# Altium schematic sheet 8_Airframe-Misc.SchDoc
size A4; SheetNumber: 8; SheetTotal: 9
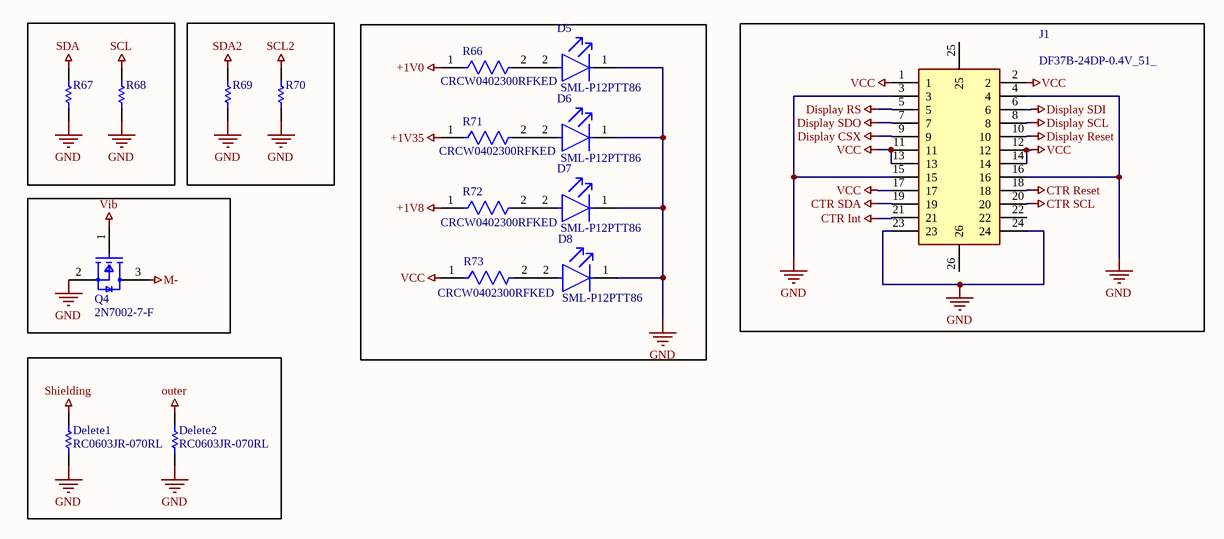
[diagram p0: 8_Airframe-Misc.SchDoc]

## Parts
D5  SML-P12PTT86  [FP-SML-P1-MFG]
D6  SML-P12PTT86  [FP-SML-P1-MFG]
D7  SML-P12PTT86  [FP-SML-P1-MFG]
D8  SML-P12PTT86  [FP-SML-P1-MFG]
Delete1  RC0603JR-070RL  [RESC1608X55X25ML10T15]
Delete2  RC0603JR-070RL  [RESC1608X55X25ML10T15]
J1  DF37B-24DP-0.4V_51_  [DF37B24DP04V51]
Q4  2N7002-7-F  [FP-SOT23-MFG]
R66  CRCW0402300RFKED  [FP-CRCW0402-e3-MFG]
R67  ERJ-2RKF4701X  [RESC1005X40X25ML05T05]  (value not drawn)
R68  ERJ-2RKF4701X  [RESC1005X40X25ML05T05]  (value not drawn)
R69  ERJ-2RKF4701X  [RESC1005X40X25ML05T05]  (value not drawn)
R70  ERJ-2RKF4701X  [RESC1005X40X25ML05T05]  (value not drawn)
R71  CRCW0402300RFKED  [FP-CRCW0402-e3-MFG]
R72  CRCW0402300RFKED  [FP-CRCW0402-e3-MFG]
R73  CRCW0402300RFKED  [FP-CRCW0402-e3-MFG]

## Nets
+1V0: R66.1
+1V8: R72.1
+1V35: R71.1
CTR Int: J1.21
CTR Reset: J1.18
CTR SCL: J1.20
CTR SDA: J1.19
Display CSX: J1.9
Display Reset: J1.10
Display RS: J1.5
Display SCL: J1.8
Display SDI: J1.6
Display SDO: J1.7
GND: D5.1(C) D6.1(C) D7.1(C) D8.1(C) Delete1.1 Delete2.1 J1.3 J1.4 J1.15 J1.16 J1.23 J1.24 Q4.2(S) R67.1 R68.1 R69.1 R70.1
M-: Q4.3(D)
outer: Delete2.2
SCL: R68.2
SCL2: R70.2
SDA: R67.2
SDA2: R69.2
Shielding: Delete1.2
VCC: J1.1 J1.2 J1.11 J1.12 J1.13 J1.14 J1.17 R73.1
Vib: Q4.1(G)
NetD5_2: D5.2(A) R66.2
NetD6_2: D6.2(A) R71.2
NetD7_2: D7.2(A) R72.2
NetD8_2: D8.2(A) R73.2

Not connected (* = marked no-connect by the designer): J1 22 25 26

## Library data of the parts
D5-D8 = CMP-08952-000020-1: LED GREEN CLEAR 1006 SMD; Manufacturer: Rohm; Led Orientation: Top View; Wavelength: 560nm; Forward Current: 20mA; Reverse Voltage: 5V; Power Dissipation: 52mW; Forward Voltage: 2.1V; Luminous Intensity: 10mcd; Device Class L1: Optoelectronics; Digikey Description: LED GREEN CLEAR 1006 SMD; Lead Free: Yes; Manufacturer Part Number: SML-P12PTT86; Temperature Range High: +85°C; Octopart: https://octopart.com/sml-p12ptt86-rohm-9290705; Device Class L2: LEDs; Colour: Green; RoHS: TRUE; Height: 0.25mm; Automotive: No; Device Class L3: unset; Temperature Range Low: -40°C; ComponentLink2Description: Datasheet; Mouser Description: Standard LEDs - SMD SMD Green 13 mcd height=0.2; Category: Diode; ComponentLink2URL: https://www.rohm.com/datasheet/SML-P12DT(R); Temperature: -40°C to +85°C; Package: SML-P1
Delete1 Delete2 = CMP-2100-03667-1: Chip Resistor, 0 Ohm, +/- 5%, 0.1 W, -55 to 155 degC, 0603 (1608 Metric), RoHS, Tape and Reel; Manufacturer: Yageo; Temperature Coefficient: 200ppm/degreesC; Voltage Rating: 50V; Power Rating: 100mW; Resistance: 0mOhm; Width: 0.8mm; Max Operating Temperature: 155degC; Tolerance: 5%; Package Reference: 0603; Height: 0.45mm; Depth: 0.8mm; Package Description: 2-Pin Surface Mount Device, Body 1.6 x 0.8 mm; Termination: SMD/SMT; Package Quantity: 5000; Case/Package: 0603; Case Code (Imperial): 0603; Radiation Hardening: No; Number of Pins: 2; Length: 1.6mm; Lead Free: LeadFree; Voltage Rating (DC): 50V; Military Standard: Not; Datasheet URL: http://www.yageo.com/NewPortal/yageodocoutput?fileName=/pdf/R-Chip/PYu-RC_Group_51_RoHS_L_5.pdf; Manufacturer URL: http://www.yageo.com/; Packaging: TapeandReel; Case Code (Metric): 1608; Min Operating Temperature: -55degC; Composition: ThickFilm; RoHSCompliant: true; Contact Plating: Tin; Datasheet Version: Rev. 5, 10/2016; REACH SVHC: NoSVHC
J1 = DF37B-24DP-0.4V_51_: Connector; Manufacturer_Name: Hirose; Manufacturer_Part_Number: DF37B-24DP-0.4V(51); Datasheet Link: https://www.hirose.com/product/download/?distributor=digikey&type=2d&lang=en&num=DF37B-24DP-0.4V(51); Mouser Part Number: 798-DF37B24DP04V51; Mouser Price/Stock: https://www.mouser.co.uk/ProductDetail/Hirose-Connector/DF37B-24DP-04V51?qs=eDUdFcBPps0B7iwhROz75A%3D%3D
Q4 = CMP-2000-04929-2: MOSFET N-CH 60V 115MA SOT23-3; Turn-On Delay Time: 7ns; Turn-Off Delay Time: 11ns; Drain to Source Resistance: 7.5R; Rise Time: 3ns; Drain to Source Breakdown Voltage: 70V; Input Capacitance: 50pF; Number of Elements: 1; Power Dissipation: 540mW; Max Power Dissipation: 300mW; Fall Time: 5.6ns; Gate to Source Voltage (Vgs): 20V; Threshold Voltage: 2.5V; Element Configuration: Single; Termination: SMD/SMT; Weight: 0.000282oz; Radiation Hardening: No; Max Operating Temperature: 150°C; On-State Resistance: 7.5R; Mount: Surface Mount; Current Rating: 115mA; Contact Plating: Tin; Lead Free: Lead Free; Min Operating Temperature: -55°C; Number of Pins: 3; REACH SVHC: No SVHC; Drain to Source Voltage (Vdss): 60V; Width: 1.3mm; Package Quantity: 3000; Length: 2.9mm; Case/Package: SOT-23; Number of Channels: 1; Dual Supply Voltage: 60V; Packaging: Tape and Reel; Height: 1mm; Voltage Rating (DC): 60V; Nominal Vgs: 2.5V; Continuous Drain Current (ID): 115mA; Voltage: 60V; Rds On Max: 7.5R
R66 R71-R73 = CMP-2002-08497-2: RES Thick Film, 300Ω, 1%, 0.063W, 100ppm/°C, 0402; Voltage Rating: 50V; Resistance: 300R; Max Power Dissipation: 63mW; Depth: 0.5mm; Tolerance: 1%; Package Quantity: 10; Temperature Coefficient: 100ppm/°C; Features: Automotive AEC-Q200; Military Standard: Not; Case Code (Metric): 1005; Voltage Rating (DC): 50V; Case/Package: 0402; Lead Free: Lead Free; Contact Plating: Tin; Min Operating Temperature: -55°C; Length: 1mm; Number of Terminations: 2; Case Code (Imperial): 0402; Weight: 2.3E-05oz; Mount: Surface Mount; Termination: SMD/SMT; Max Operating Temperature: 155°C; Width: 0.02inch; Composition: Thick Film; Height: 0.35mm; Power Rating: 63mW; Radiation Hardening: No; Packaging: Tape and Reel
R67-R70 = CMP-2002-01154-4: Chip Resistor, 4.7 KOhm, +/- 1%, 0.1 W, -55 to 155 degC, 0402 (1005 Metric), RoHS, Tape and Reel; Voltage Rating: 50 V; Case\/Package: 0402; Power Rating: 100 mW; Height: 0.35 mm; Mounting Technology: Surface Mount; REACH SVHC: Yes; Resistance: 4.7 KOhm; Max Operating Temperature: 155 degC; ComponentLink1Description: Manufacturer URL; ComponentLink2Description: Datasheet; Pins: 2; PackageReference: 0402; Tolerance: 1%; Case Code (Imperial): 0402; Length: 1 mm; PackageDescription: 2-Pin Surface Mount Device, Body 1 x 0.5 mm; PartNumber: ERJ-2RKF4701X; RoHSCompliant: true; Package Quantity: 1; Radiation Hardening: No; DatasheetVersion: 04/2015; Width: 0.5 mm; Case Code (Metric): 1005; Mount: Surface Mount; ComponentLink1URL: http://www.panasonic.com/; Min Operating Temperature: -55 degC; Packaging: Cut Tape; ComponentLink2URL: http://industrial.panasonic.com/cdbs/www-data/pdf/RDA0000/AOA0000C86.pdf